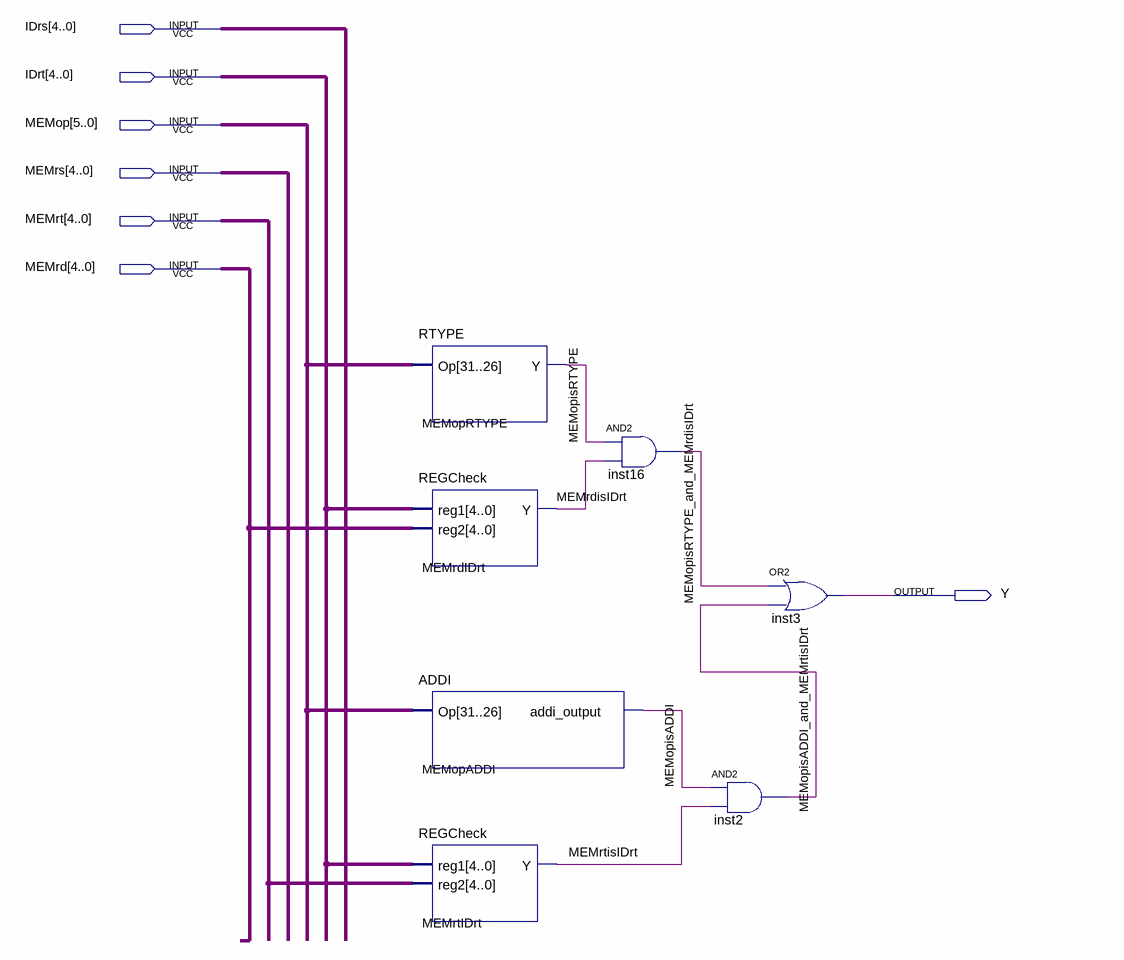
[diagram p0: schematic sheet]
// Quartus schematic ForwardBfromMEMtoID.bdf as structural Verilog: 7 symbols, 7 pins
module ForwardBfromMEMtoID (
  input  [4:0] IDrs,
  input  [4:0] IDrt,
  input  [5:0] MEMop,
  input  [4:0] MEMrs,
  input  [4:0] MEMrt,
  input  [4:0] MEMrd,
  output Y
);

  wire MEMopisADDI, MEMopisADDI_and_MEMrtisIDrt, MEMopisRTYPE, MEMopisRTYPE_and_MEMrdisIDrt, MEMrdisIDrt,
       MEMrtisIDrt;

  RTYPE MEMopRTYPE (.Op(MEMop), .Y(MEMopisRTYPE));
  REGCheck MEMrdIDrt (.reg1(IDrt), .reg2(MEMrd), .Y(MEMrdisIDrt));
  ADDI MEMopADDI (.Op(MEMop), .addi_output(MEMopisADDI));
  REGCheck MEMrtIDrt (.reg1(IDrt), .reg2(MEMrt), .Y(MEMrtisIDrt));
  and inst16 (MEMopisRTYPE_and_MEMrdisIDrt, MEMopisRTYPE, MEMrdisIDrt);
  or inst3 (Y, MEMopisRTYPE_and_MEMrdisIDrt, MEMopisADDI_and_MEMrtisIDrt);
  and inst2 (MEMopisADDI_and_MEMrtisIDrt, MEMopisADDI, MEMrtisIDrt);
endmodule
